# EasyEDA Pro project 4x4矩阵按键.epro

# Schematic Schematic1
Board Name: Board1; Create Date: 2025-05-09; Page Name: P1; Project Name: 矩阵按键; Schematic Name: Schematic1; Update Date: 2025-05-09; Company: 嘉立创EDA; Page Size: A4; Version: V1.0
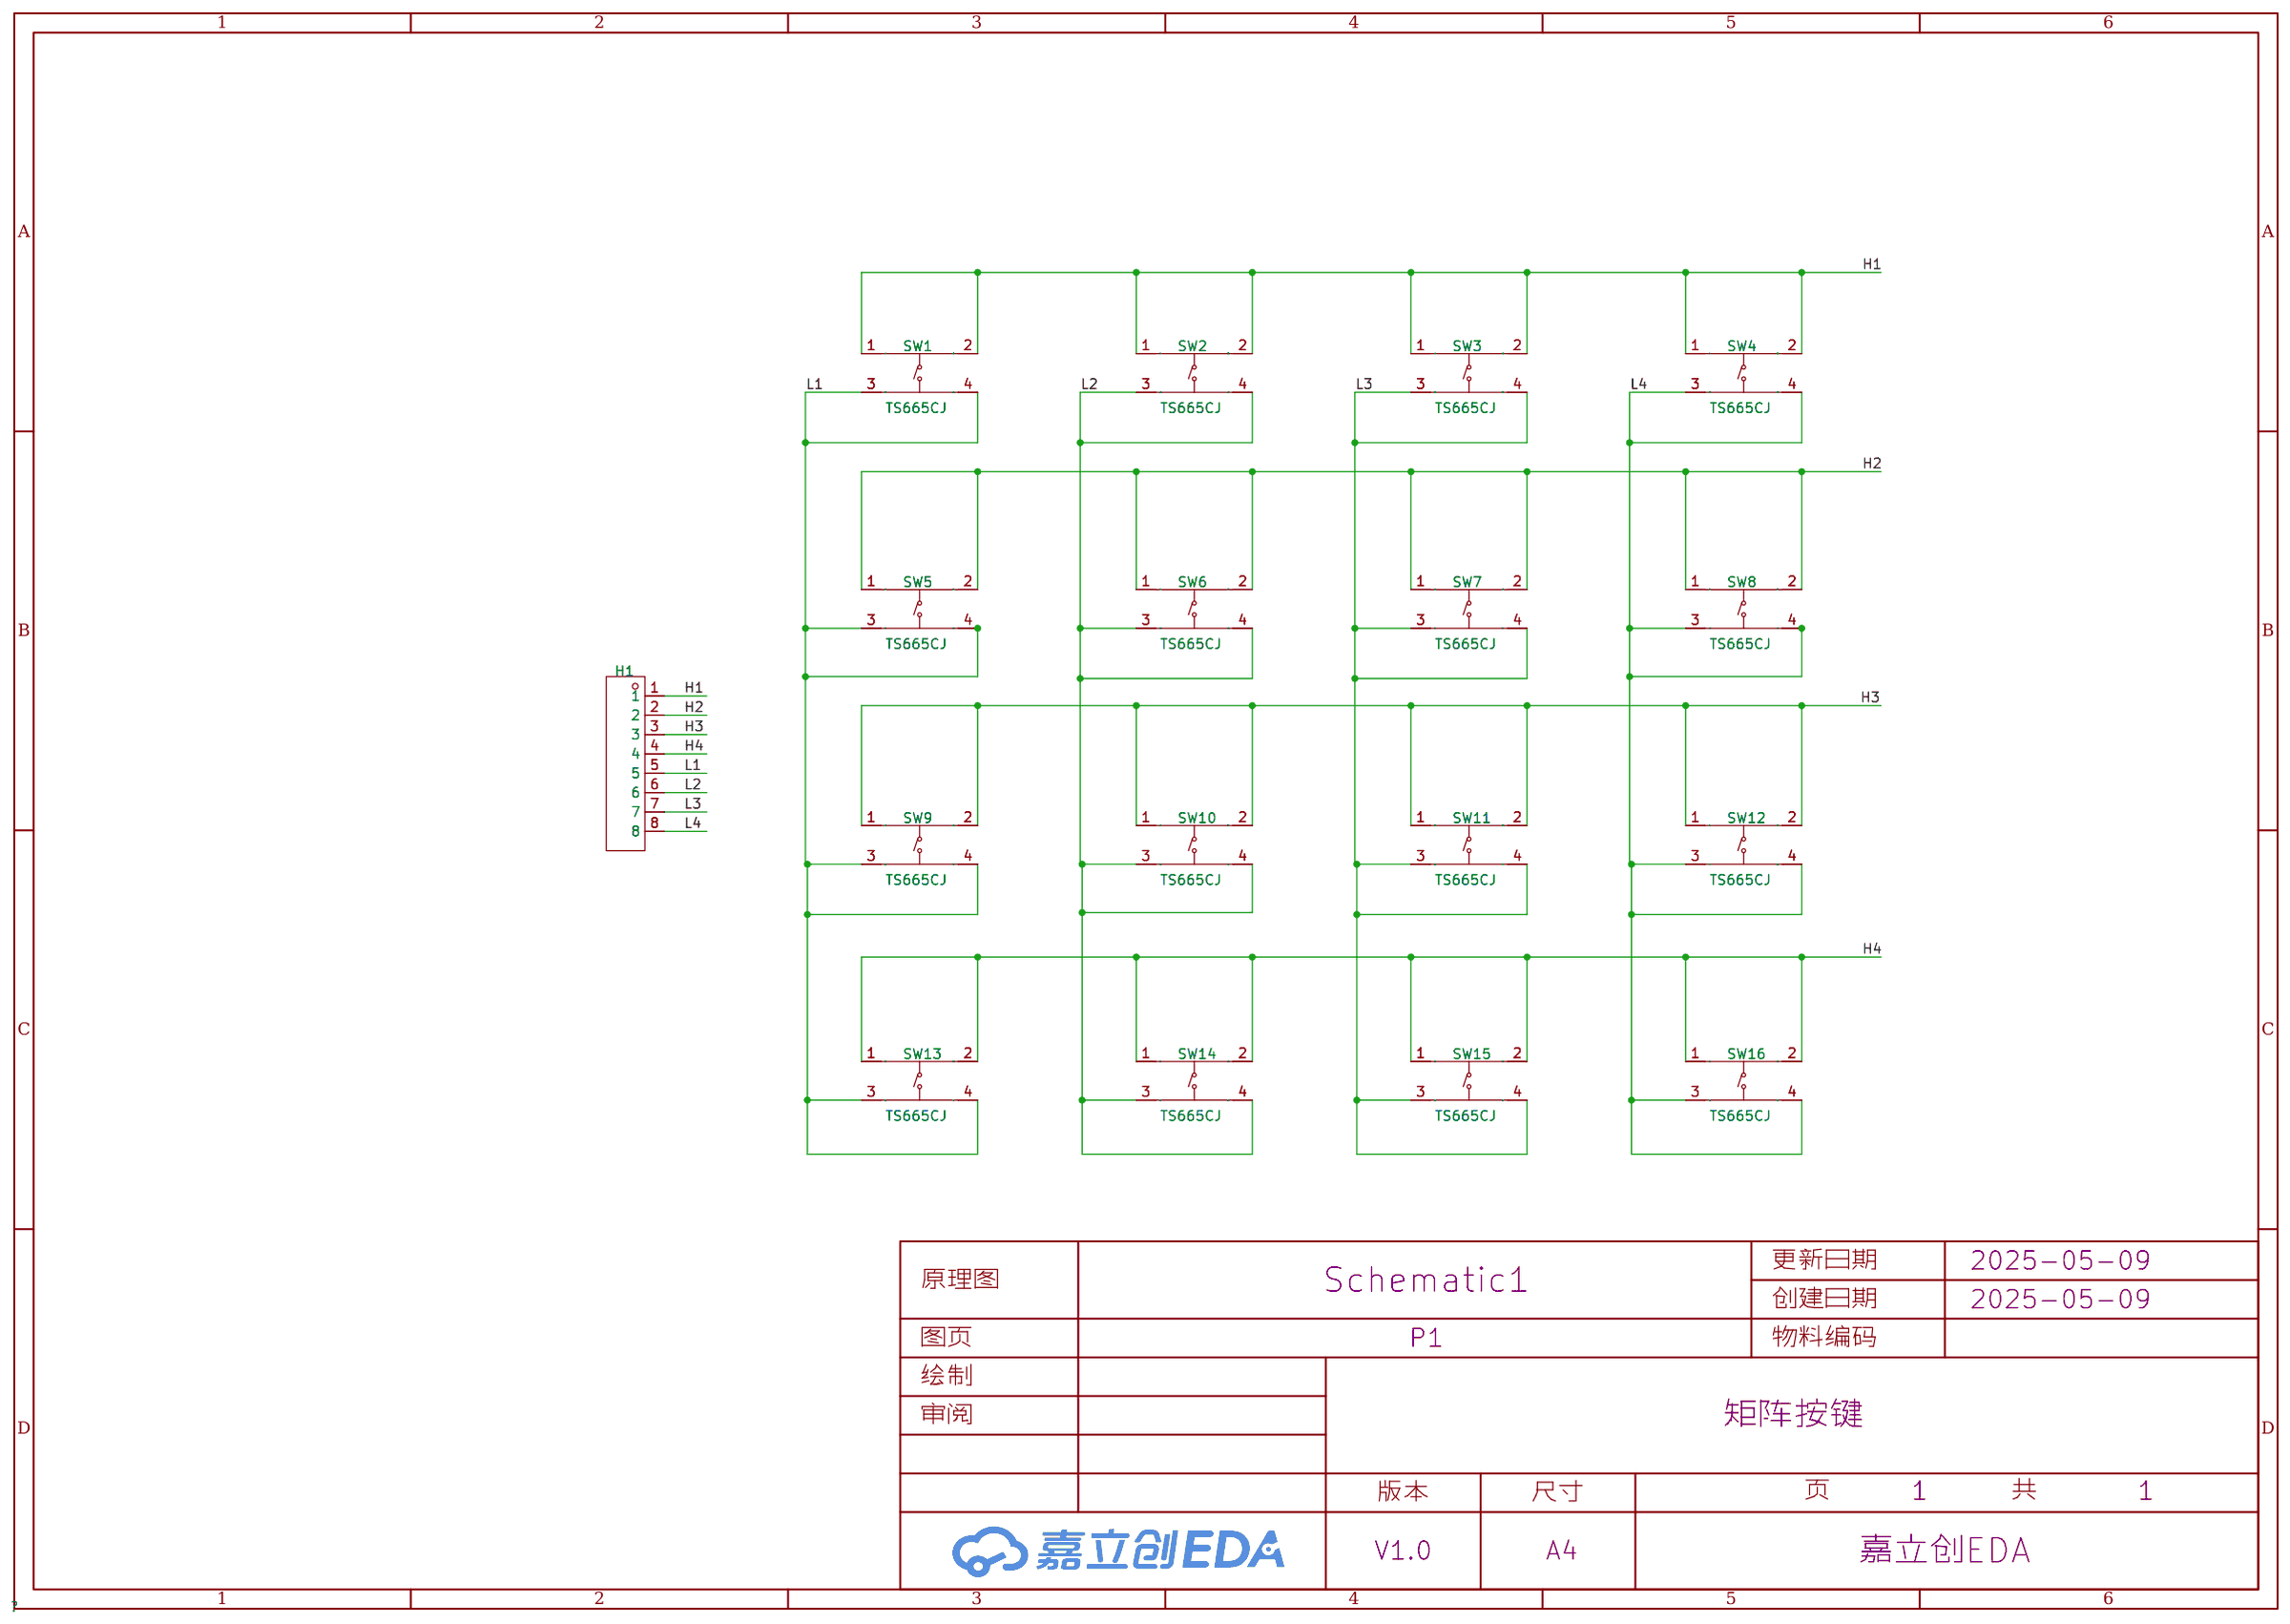
[diagram p0: schematic sheet]

## Parts
H1  PZ254V-11-08P  [HDR-TH_8P-P2.54-V-M]
SW1  TS665CJ  [SW-TH_4P-L6.0-W6.0-P4.50-LS6.5]
SW2  TS665CJ  [SW-TH_4P-L6.0-W6.0-P4.50-LS6.5]
SW3  TS665CJ  [SW-TH_4P-L6.0-W6.0-P4.50-LS6.5]
SW4  TS665CJ  [SW-TH_4P-L6.0-W6.0-P4.50-LS6.5]
SW5  TS665CJ  [SW-TH_4P-L6.0-W6.0-P4.50-LS6.5]
SW6  TS665CJ  [SW-TH_4P-L6.0-W6.0-P4.50-LS6.5]
SW7  TS665CJ  [SW-TH_4P-L6.0-W6.0-P4.50-LS6.5]
SW8  TS665CJ  [SW-TH_4P-L6.0-W6.0-P4.50-LS6.5]
SW9  TS665CJ  [SW-TH_4P-L6.0-W6.0-P4.50-LS6.5]
SW10  TS665CJ  [SW-TH_4P-L6.0-W6.0-P4.50-LS6.5]
SW11  TS665CJ  [SW-TH_4P-L6.0-W6.0-P4.50-LS6.5]
SW12  TS665CJ  [SW-TH_4P-L6.0-W6.0-P4.50-LS6.5]
SW13  TS665CJ  [SW-TH_4P-L6.0-W6.0-P4.50-LS6.5]
SW14  TS665CJ  [SW-TH_4P-L6.0-W6.0-P4.50-LS6.5]
SW15  TS665CJ  [SW-TH_4P-L6.0-W6.0-P4.50-LS6.5]
SW16  TS665CJ  [SW-TH_4P-L6.0-W6.0-P4.50-LS6.5]

## Library data of the parts
H1 = PZ254V-11-08P: 插针结构:1x8P;间距:2.54mm;行距:-;圆针/方针:方针;安装类型:直插;排数:单排;总PIN位数:8P;额定电流:-;额定电压:-;配合针长度:6mm;塑高:2.5mm;端接针长度:3mm;触头材质:黄铜;触头镀层:-;工作温度范围:-40℃~+105℃;颜色:黑色;; LCSC Part Name: 间距:2.54mm 1x8P 直插 方针; Supplier Part: C492407; Manufacturer: XFCN(兴飞); Supplier Footprint: 插件,P=2.54mm; JLCPCB Part Class: 扩展库; Datasheet: https://atta.szlcsc.com/upload/public/pdf/source/20200309/C492407_83A6FB26A2233368EDB9516968EC6149.pdf; Supplier: LCSC; Pin Structure: 1x8P; Pitch: 2.54mm; Circluar Pins/Square Pins: 方针; Mounting Type: 直插; Number of Rows: 单排; Number of Pins: 8P; Length of Mating Pin: 6mm; Insulation Height: 2.5mm; Length of End Connection Pin: 3mm; Contact Material: 黄铜; Operating Temperature Range: -40℃~+105℃; Color: 黑色
SW1-SW16 = TS665CJ: 电路结构:单刀单掷;按钮形状:圆形按钮;安装方式:直插;开关长度:6mm;开关宽度:6mm;开关高度:5mm;触点电流:50mA;额定电压(DC):12V;带灯:-;机械寿命:-;; LCSC Part Name: 6*6*5mm 直插 轻触开关; Supplier Part: C393938; Manufacturer: SHOU HAN(首韩); Supplier Footprint: 插件; JLCPCB Part Class: 扩展库; Datasheet: https://atta.szlcsc.com/upload/public/pdf/source/20190521/C393938_BDABEAC600B4C55E200A80AA129B70BC.pdf; Supplier: LCSC; Circuit: 单刀单掷; Actuator Style: 圆形按钮; Mounting Style: 直插; Switch Length: 6mm; Switch Width: 6mm; Switch Height: 5mm; Contact Current: 50mA; Voltage Rating (DC): 12V

## Nets
H1: H1.1 SW1.1(A) SW1.2(B) SW2.1(A) SW2.2(B) SW3.1(A) SW3.2(B) SW4.1(A) SW4.2(B)
H2: H1.2 SW5.1(A) SW5.2(B) SW6.1(A) SW6.2(B) SW7.1(A) SW7.2(B) SW8.1(A) SW8.2(B)
H3: H1.3 SW9.1(A) SW9.2(B) SW10.1(A) SW10.2(B) SW11.1(A) SW11.2(B) SW12.1(A) SW12.2(B)
H4: H1.4 SW13.1(A) SW13.2(B) SW14.1(A) SW14.2(B) SW15.1(A) SW15.2(B) SW16.1(A) SW16.2(B)
L1: H1.5 SW1.3(C) SW1.4(D) SW5.3(C) SW5.4(D) SW9.3(C) SW9.4(D) SW13.3(C) SW13.4(D)
L2: H1.6 SW2.3(C) SW2.4(D) SW6.3(C) SW6.4(D) SW10.3(C) SW10.4(D) SW14.3(C) SW14.4(D)
L3: H1.7 SW3.3(C) SW3.4(D) SW7.3(C) SW7.4(D) SW11.3(C) SW11.4(D) SW15.3(C) SW15.4(D)
L4: H1.8 SW4.3(C) SW4.4(D) SW8.3(C) SW8.4(D) SW12.3(C) SW12.4(D) SW16.3(C) SW16.4(D)

# Board PCB1
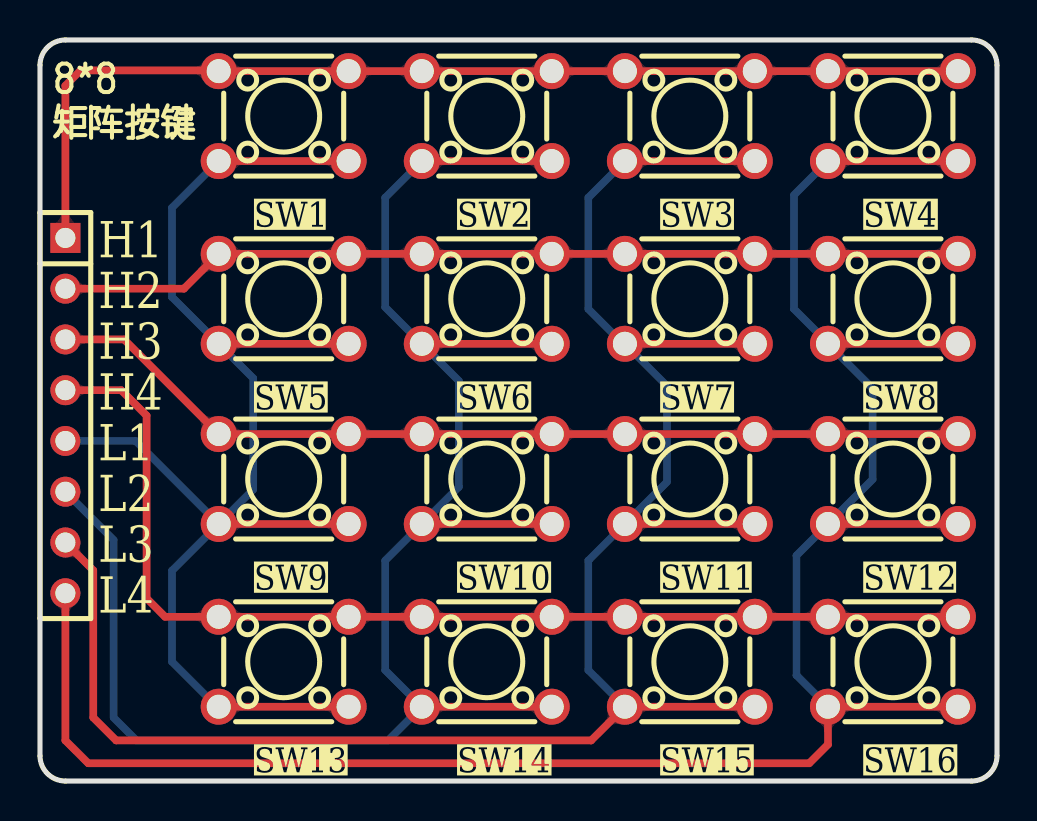
[diagram p1: board, top side]
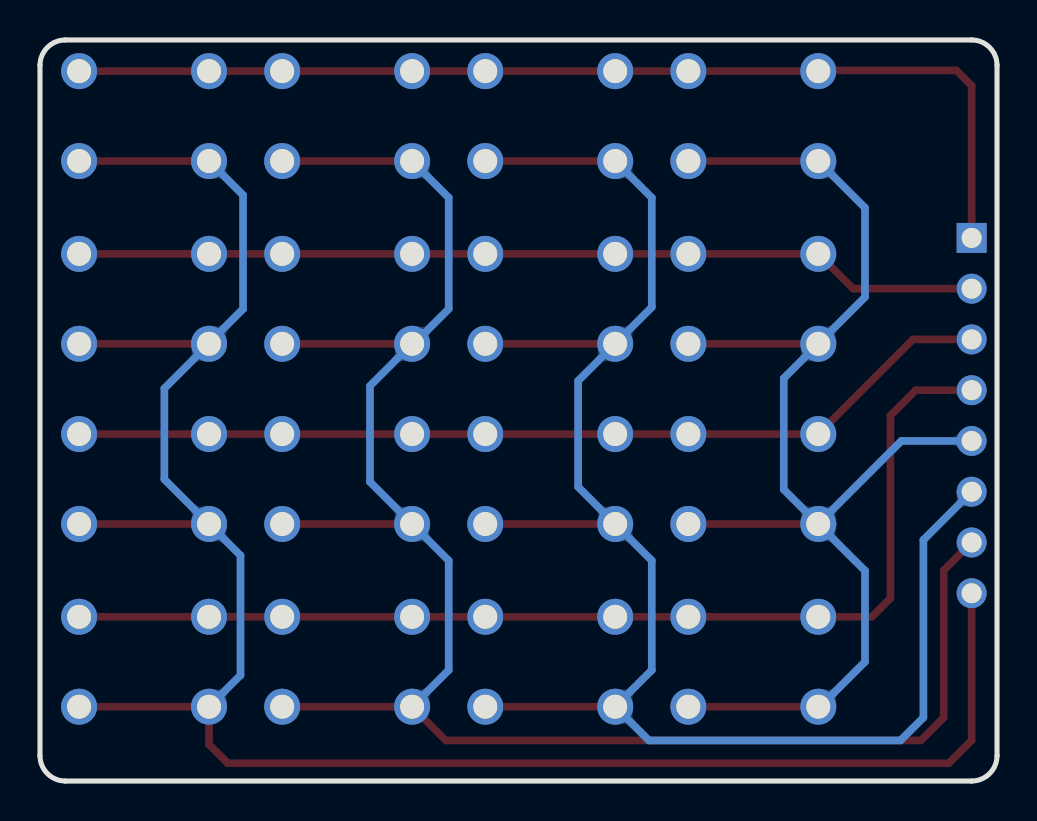
[diagram p2: board, bottom side, seen from below]

Outline 47.88 x 37.08 mm; copper layers: Top Layer, Bottom Layer. Coordinates in mm from the lower left corner of the outline.
Outline path: 0,35.81 0,1.27 arc(0.37,0.37) 1.27,0 46.61,0 arc(47.51,0.37) 47.88,1.27 47.88,35.81 arc(47.51,36.71) 46.61,37.08 1.27,37.08 arc(0.37,36.71) 0,35.81
Stack: Top Layer 0.035mm / Dielectric1 1.51mm FR4 er 4.5 / Bottom Layer 0.035mm

## Design rules (mm)
template: 自定义配置
spacing copperThickness1oz (default): track to track 0.102, other pairs 0.152 to 0.3
spacing copperThickness2oz: track to track 0.203, other pairs 0.152 to 0.3
track width copperThickness1oz (default): min 0.381, default 0.381, max 2.54
track width copperThickness2oz: min 0.203, default 0.254, max 2.54
differential pair differentialPair (default): width min 0.127, default 0.254, max 2.54; gap min 0.152, default 0.152
via viaSize (default): diameter min 0.5, default 0.61, max 10; hole min 0.3, default 0.305, max 6.3

## Placement (name value [footprint] x y rotation side)
H1  PZ254V-11-08P  [HDR-TH_8P-P2.54-V-M]  1.27 18.29 270 top
SW1  TS665CJ  [SW-TH_4P-L6.0-W6.0-P4.50-LS6.5]  12.19 33.27 0 top
SW2  TS665CJ  [SW-TH_4P-L6.0-W6.0-P4.50-LS6.5]  22.35 33.27 0 top
SW3  TS665CJ  [SW-TH_4P-L6.0-W6.0-P4.50-LS6.5]  32.51 33.27 0 top
SW4  TS665CJ  [SW-TH_4P-L6.0-W6.0-P4.50-LS6.5]  42.67 33.27 0 top
SW5  TS665CJ  [SW-TH_4P-L6.0-W6.0-P4.50-LS6.5]  12.19 24.13 0 top
SW6  TS665CJ  [SW-TH_4P-L6.0-W6.0-P4.50-LS6.5]  22.35 24.13 0 top
SW7  TS665CJ  [SW-TH_4P-L6.0-W6.0-P4.50-LS6.5]  32.51 24.13 0 top
SW8  TS665CJ  [SW-TH_4P-L6.0-W6.0-P4.50-LS6.5]  42.67 24.13 0 top
SW9  TS665CJ  [SW-TH_4P-L6.0-W6.0-P4.50-LS6.5]  12.19 15.11 0 top
SW10  TS665CJ  [SW-TH_4P-L6.0-W6.0-P4.50-LS6.5]  22.35 15.11 0 top
SW11  TS665CJ  [SW-TH_4P-L6.0-W6.0-P4.50-LS6.5]  32.51 15.11 0 top
SW12  TS665CJ  [SW-TH_4P-L6.0-W6.0-P4.50-LS6.5]  42.67 15.11 0 top
SW13  TS665CJ  [SW-TH_4P-L6.0-W6.0-P4.50-LS6.5]  12.19 5.97 0 top
SW14  TS665CJ  [SW-TH_4P-L6.0-W6.0-P4.50-LS6.5]  22.35 5.97 0 top
SW15  TS665CJ  [SW-TH_4P-L6.0-W6.0-P4.50-LS6.5]  32.51 5.97 0 top
SW16  TS665CJ  [SW-TH_4P-L6.0-W6.0-P4.50-LS6.5]  42.67 5.97 0 top

## Footprints (pads in the part's own frame, mm; a bottom-side part is the same pattern mirrored in y, then rotated)
HDR-TH_8P-P2.54-V-M
  rect 1.5x1.5 hole 1: 1(-8.89,0)
  round 1.5 hole 1: 2(-6.35,0) 3(-3.81,0) 4(-1.27,0) 5(1.27,0) 6(3.81,0) 7(6.35,0) 8(8.89,0)
SW-TH_4P-L6.0-W6.0-P4.50-LS6.5
  round 1.8 hole 1.2: 1(-3.25,2.25) 2(3.25,2.25) 3(-3.25,-2.25) 4(3.25,-2.25)

## Nets
As in the schematic.

## Routing (per net, layer and track width the routed paths; a pad name or vN(x,y) marks a point on that pad's centre or on a via; arc(x,y) is an arc through that point)
H1: length 52.6
  Top Layer w0.381: H1.1 1.27,34.8 2.03,35.56 8.91,35.56 SW1.1 SW1.2 SW2.1 SW2.2 SW3.1 SW3.2 SW4.1 SW4.2
H2: length 45.4
  Top Layer w0.381: SW8.2 SW8.1 SW7.2 SW7.1 SW6.2 SW6.1 SW5.2 SW5.1 7.2,24.64 H1.2
H3: length 46.6
  Top Layer w0.381: SW12.2 SW12.1 SW11.2 SW11.1 SW10.2 SW10.1 SW9.2 SW9.1 4.21,22.1 H1.3
H4: length 54.7
  Top Layer w0.381: SW16.2 SW16.1 SW15.2 SW15.1 SW14.2 SW14.1 SW13.2 SW13.1 6.26,8.22 5.33,9.14 5.33,18.29 4.06,19.56 H1.4
L1: length 68.1
  Top Layer w0.381: SW13.4 SW13.3 ; SW9.4 SW9.3 ; SW1.4 SW1.3 ; SW5.4 SW5.3
  Bottom Layer w0.381: SW9.3 6.6,10.53 6.6,5.97 8.85,3.72 SW13.3 ; SW9.3 4.79,17.02 H1.5 ; SW9.3 10.67,14.59 10.67,20.15 SW5.3 6.6,24.22 6.6,28.69 SW1.3
L2: length 86.8
  Top Layer w0.381: SW10.3 SW10.4 ; SW14.3 SW14.4 ; SW2.3 SW2.4 ; SW6.3 SW6.4
  Bottom Layer w0.381: H1.6 3.68,12.06 3.68,3.17 4.83,2.03 17.41,2.03 SW14.3 17.27,5.55 17.27,11.03 SW10.3 20.96,14.72 20.96,20.03 SW6.3 17.27,23.71 17.27,29.19 SW2.3
L3: length 95.2
  Top Layer w0.381: SW7.4 SW7.3 ; H1.7 2.67,10.54 2.67,3.17 3.81,2.03 27.57,2.03 SW15.3 SW15.4 ; SW3.4 SW3.3 ; SW11.4 SW11.3
  Bottom Layer w0.381: SW3.3 27.43,29.19 27.43,23.62 29.17,21.88 SW7.3 31.37,19.77 31.37,14.97 SW11.3 27.43,11.03 27.43,5.55 SW15.3
L4: length 106.1
  Top Layer w0.381: SW8.4 SW8.3 ; SW16.4 SW16.3 39.42,1.83 38.48,0.89 2.41,0.89 1.27,2.03 H1.8 ; SW12.4 SW12.3 ; SW4.4 SW4.3
  Bottom Layer w0.381: SW4.3 37.72,29.32 37.72,23.62 39.42,21.92 SW8.3 41.66,19.65 41.66,15.1 SW12.3 37.85,11.29 37.85,5.3 SW16.3

Small or netless copper shapes (teardrops, artwork), in the pictures only: 100 on Top Layer, 28 on Bottom Layer

## Text on the board
Top Silkscreen Layer: 8*8 / 矩阵按键 | L1 | L2 | L3 | L4 | H1 | H2 | H3 | H4
